# Altium schematic sheet LED_7_Series.SchDoc: LED Series
size A
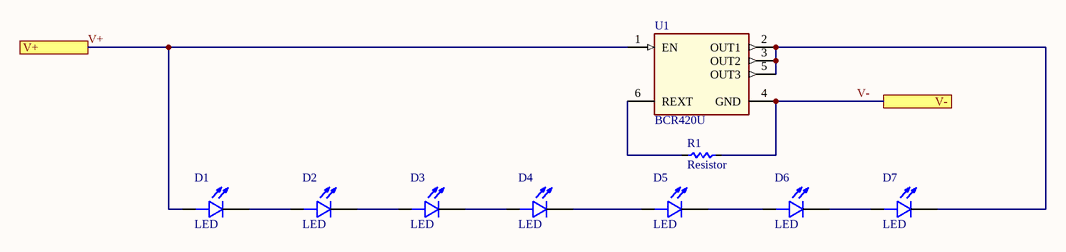
[diagram p0: LED_7_Series.SchDoc]

## Parts
D1  LED  [LED2835N]
D2  LED  [LED2835N]
D3  LED  [LED2835N]
D4  LED  [LED2835N]
D5  LED  [LED2835N]
D6  LED  [LED2835N]
D7  LED  [LED2835N]
R1  Resistor  [RES1206]
U1  BCR420U  [BCR420U]

## Ports
V+, V-

## Nets
V+: D1.A U1.1(EN) ; port V+
V-: R1.1 U1.4(GND) ; port V-
NetD1_C: D1.C D2.A
NetD2_C: D2.C D3.A
NetD3_C: D3.C D4.A
NetD4_C: D4.C D5.A
NetD5_C: D5.C D6.A
NetD6_C: D6.C D7.A
NetD7_C: D7.C U1.2(OUT1) U1.3(OUT2) U1.5(OUT3)
NetR1_2: R1.2 U1.6(REXT)